# Altium schematic sheet tempmontoring.SchDoc
size A4; SheetNumber: 1; SheetTotal: 1; SPICEModelCacheGFTFCOVI: <root> / <DocumentId>GFTFCOVI</DocumentId> / </root>
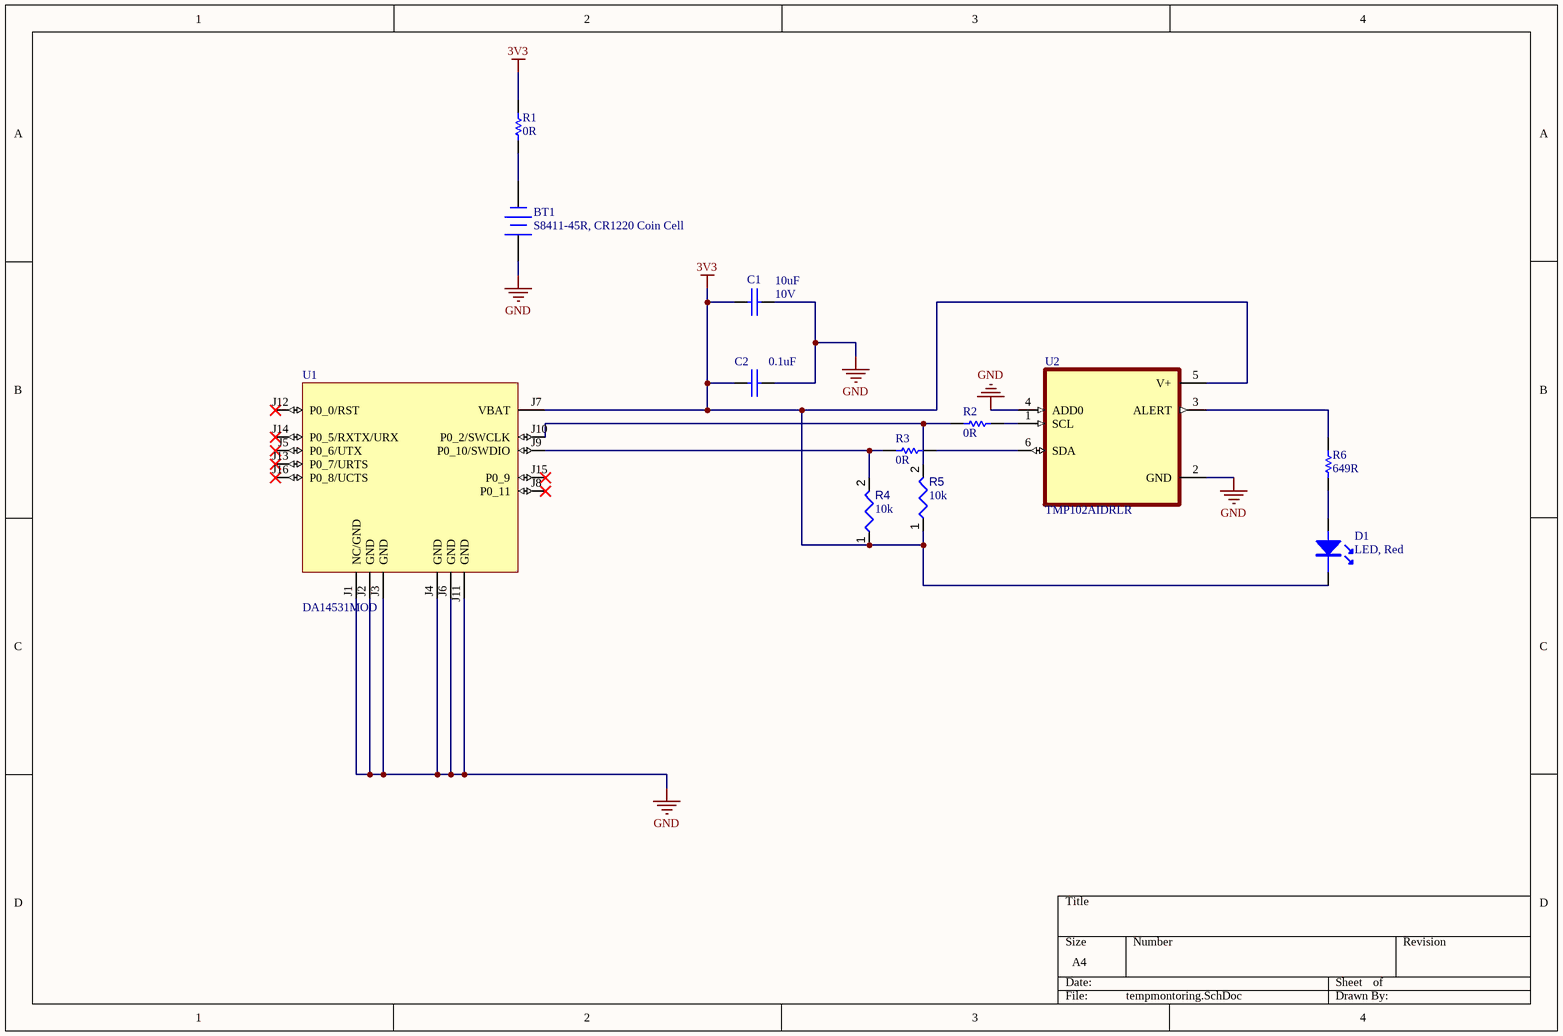
[diagram p0: tempmontoring.SchDoc]

## Parts
BT1  S8411-45R, CR1220 Coin Cell  [HWN_S8411-45R]
C1  10uF  Voltage Rating: 10V  [CAPC1608X10N]
C2  0.1uF  [CAPC1608X09N]
D1  LED, Red  [DIOC2012X08N_WTE]
R1  0R  [RESC1608X06N]
R2  0R  [RESC1608X06N]
R3  0R  [RESC1608X06N]
R4  value 10k  [RESC0402(1005)_L]  (hidden comment: Resistor 10K  +/-1 % 0402 63 mW)
R5  value 10k  [RESC0402(1005)_L]  (hidden comment: Resistor 10K  +/-1 % 0402 63 mW)
R6  649R  [RESC1608X06N]
U1  DA14531MOD  [DLG_DA14531MOD-00F01002]
U2  TMP102AIDRLR  [SOT50P160X60-6N]

## Nets
3V3: C1.1 C2.1 D1.K R1.1 R4.1 R5.1 U1.J7(VBAT) U2.5(V+)
GND: BT1.1(+) C1.2 C2.2 U1.J1(NC/GND) U1.J2(GND) U1.J3(GND) U1.J4(GND) U1.J6(GND) U1.J11(GND) U2.2(GND) U2.4(ADD0)
NetBT1_2: BT1.2(-) R1.2
NetD1_A: D1.A R6.2
NetR2_1: R2.1 R5.2 U1.J10(P0_2/SWCLK)
NetR2_2: R2.2 U2.1(SCL)
NetR3_1: R3.1 R4.2 U1.J9(P0_10/SWDIO)
NetR3_2: R3.2 U2.6(SDA)
NetR6_1: R6.1 U2.3(ALERT)

Not connected (* = marked no-connect by the designer): U1 J5(P0_6/UTX)* J8(P0_11)* J12(P0_0/RST)* J13(P0_7/URTS)* J14(P0_5/RXTX/URX)* J15(P0_9)* J16(P0_8/UCTS)*

## Library data of the parts
BT1 = BT-S8411-45R-SR-HWN: Battery Holder, 12 mm Coin Cell, CR1220 SM; Manufacturer: Harwin; Detailed Description: Battery Holder, 12 mm Coin Cell, CR1220, SM, RoHS; Part: S8411-45R, CR1220 Coin Cell; Type: Battery Holder; Manufacturer's Part #: S8411-45R; Revision: 1; Supplier 1: Digi-Key; Supplier 2: Mouser; Supplier Part Number 1: 952-1745-1-ND; Supplier Part Number 2: 855-S8411-45R
C1 = CI-10uF-10V-X5R-SR-MRT: Capacitor, 10uF, 10V, SM; Manufacturer's Part #: GRM188R61A106KE69D; Manufacturer: Murata; Detailed Description: Capacitor, 10uF, 10V, SM 0603, Multilayer Ceramic, X5R, RoHS; Tolerance: 10%; Part: 10uF; Type: Capacitor; Revision: 1; Supplier 1: Digi-Key; Supplier 2: Mouser; Supplier Part Number 1: 490-10474-1-ND; Supplier Part Number 2: 81-GRM188R61A106KE9D; Package: 0603
C2 = CI-0.1uF-50V-X7R-SR-YAG: Capacitor, 0.1uF, 50V, SM; Manufacturer's Part #: CC0603KRX7R9BB104; Manufacturer: Yageo; Detailed Description: Capacitor, 0.1uF, 50V, SM 0603, Multilayer Ceramic,, X7R, RoHS; Tolerance: 10%; Part: 0.1uF; Type: Capacitor; Revision: 1; Package: 0603; Voltage Rating: 50V; Supplier 1: Digi-Key; Supplier 2: Future Electronics; Supplier 3: Mouser; Supplier Part Number 1: 311-1344-1-ND; Supplier Part Number 2: 9017302; Supplier Part Number 3: 603-CC603KRX7R9BB104
D1 = DA-150080RS75000-SR-WTE: LED, Red, 0805 SM; Manufacturer: Wurth Elektronik; Detailed Description: LED, Red, Clear, 0805, SM, RoHS; Part: LED, Red; Type: LED; Manufacturer's Part #: 150080RS75000; Revision: 1; Package: 0805; Supplier 1: Digi-Key; Supplier 2: Mouser; Supplier Part Number 1: 732-4984-1-ND; Supplier Part Number 2: 710-150080RS75000
R1-R3 = RP-0-SR-KOA: Resistor, 0 ohms, 1/8W, 1%, SM; Manufacturer's Part #: RK73Z1JTTD; Manufacturer: KOA Speer; Detailed Description: Resistor, 0 ohms, 1/8W, 1%, 100 ppm, SM, 75 WV, 100 OV, Thick Film, 0603, RoHS; Voltage Rating: 75V; Resistance: 0; Part: 0R; Type: Resistor; Revision: 1; Power Rating: 1/8W; Tolerance: 1%; Package: 0603; Supplier 1: Arrow Electronics; Supplier 2: Digi-Key; Supplier 3: Mouser; Supplier Part Number 1: RK73Z1JTTD; Supplier Part Number 2: 2019-RK73Z1JTTDCT-ND; Supplier Part Number 3: 660-RK73Z1JTTD
R4 R5 = CMP-009-00149-3: Chip Resistor, 10 kOhms, +/-1 %, 63 mW, -55 to 125 degC, 0402; Power: 63mW; Tolerance: 1%; Min Operating Temperature: -55°C; Case/Package: 0402; Max Operating Temperature: 155°C; Pins: 2
R6 = RP-649-SR-KOA: Resistor, 649 ohms, 1/8W, 1%, SM; Manufacturer's Part #: RK73H1JTTD6490F; Manufacturer: KOA Speer; Detailed Description: Resistor, 649 ohms, 1/8W, 1%, 100 ppm, SM, 75 WV, 100 OV, Thick Film, 0603, RoHS; Voltage Rating: 75V; Resistance: 649; Part: 649R; Type: Resistor; Revision: 1; Power Rating: 1/8W; Tolerance: 1%; Package: 0603; Supplier 1: Digi-Key; Supplier 2: Mouser; Supplier 3: Arrow Electronics; Supplier Part Number 1: 2019-RK73H1JTTD6490FCT-ND; Supplier Part Number 2: 660-RK73H1JTTD6490F; Supplier Part Number 3: RK73H1JTTD6490F
U1 = UD-DA14531MOD-00F01002-SR-DLG: DA14531MOD, Bluetooth Low Energy 5.1 Module, SM; Manufacturer 1: Renesas Electronics; Detailed Description: DA14531MOD, Bluetooth Low Energy 5.1 Module, 128 kB Flash, 144kB ROM, 48kB RAM, 16-SMD Module, SM, RoHS; Manufacturer Part Number 1: DA14531MOD-00F01002; Part: DA14531MOD; Type: BLE 5.1 Module; Revision: 1; Package: 16-SMD Module; Supplier 1: Digi-Key; Supplier 2: Mouser; Supplier Part Number 1: 1695-DA14531MOD-00F01002CT-ND; Supplier Part Number 2: 724-DA14531MODF01002
U2 = TMP102AIDRLR: 2C digital temperature sensor, I2C/SMBus in 2.56mm2 package; MF: Texas Instruments; Check_prices: https://www.snapeda.com/parts/TMP102AIDRLR/Texas+Instruments/view-part/?ref=eda; Value: *; Availability: In Stock; MP: TMP102AIDRLR; Price: None; Package: SOT-5X3-6 Texas Instruments; SnapEDA_Link: https://www.snapeda.com/parts/TMP102AIDRLR/Texas+Instruments/view-part/?ref=snap; Purchase-URL: https://pricing.snapeda.com/search/part/TMP102AIDRLR/?ref=eda